# Altium schematic sheet mcu.SchDoc
size A3
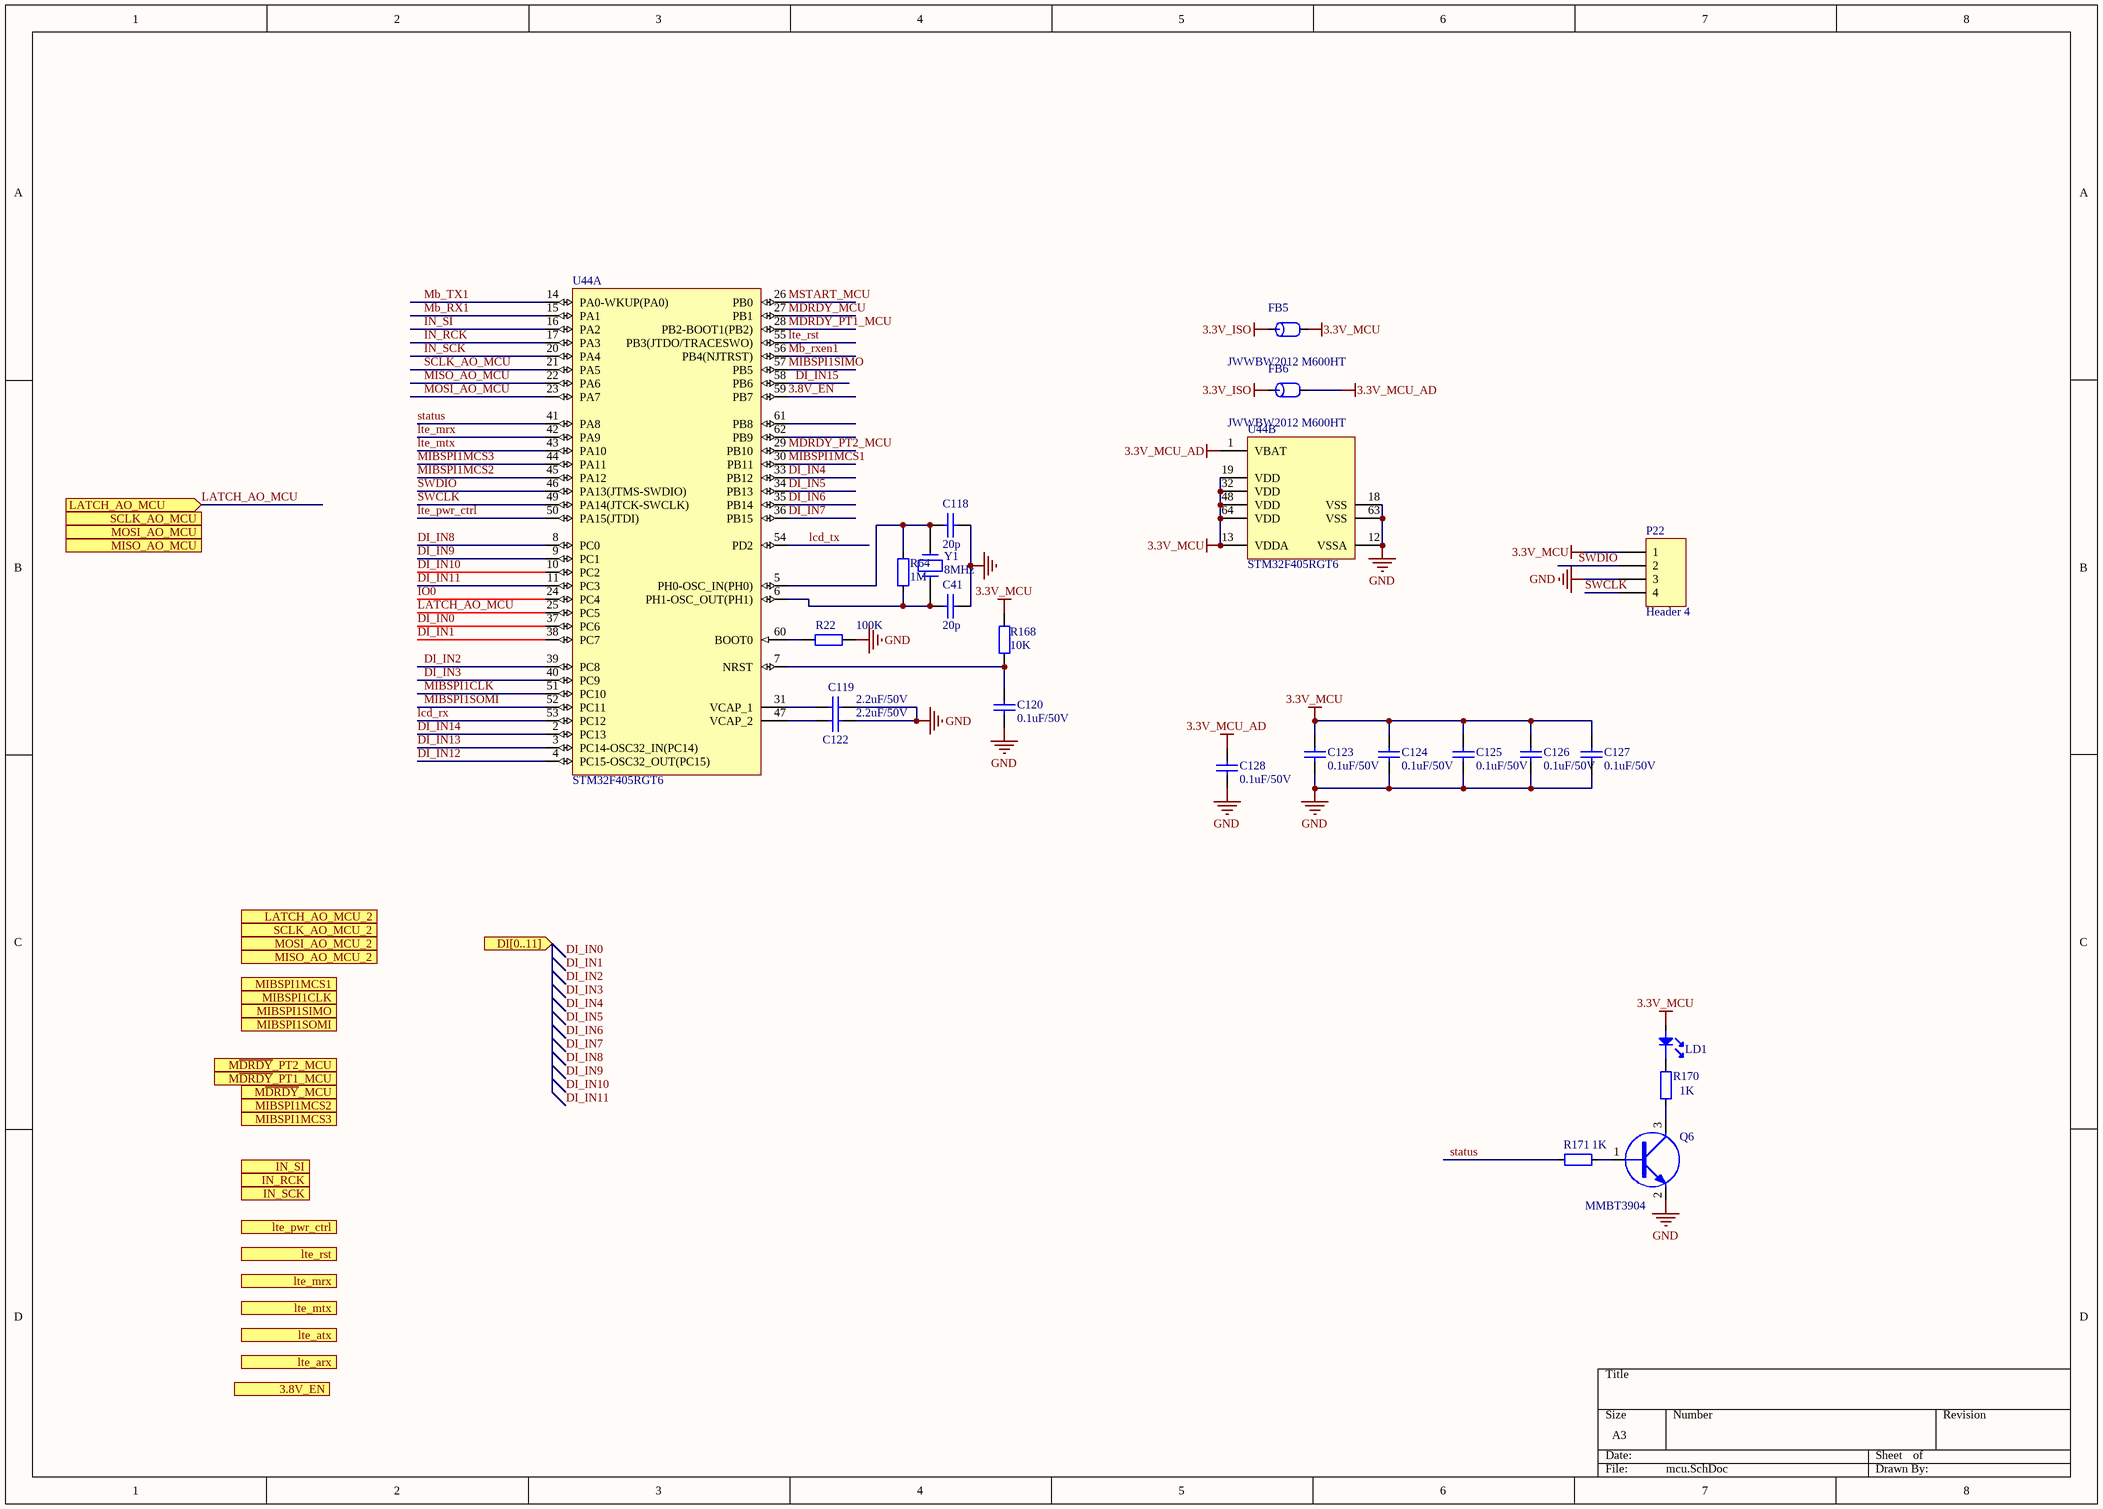
[diagram p0: mcu.SchDoc]

## Parts
C41  20p  [0603c]
C118  20p  [0603c]
C119  2.2uF/50V  [0603C]
C120  0.1uF/50V  [0603C]
C122  2.2uF/50V  [0603C]
C123  0.1uF/50V  [0603C]
C124  0.1uF/50V  [0603C]
C125  0.1uF/50V  [0603C]
C126  0.1uF/50V  [0603C]
C127  0.1uF/50V  [0603C]
C128  0.1uF/50V  [0603C]
FB5  JWWBW2012 M600HT  [0805R]
FB6  JWWBW2012 M600HT  [0805R]
LD1  LED_Green_19-217  [0603led]  (value not drawn)
P22  Header 4  [HDR1X4]
Q6  MMBT3904  [SOT23-3]
R22  100K  [0603R]
R64  1M  [0603R]
R168  10K  [0603R]
R170  1K  [0603r]
R171  1K  [0603r]
U44  STM32F405RGT6  [LQFP-64]  (parts A,B of 2)
Y1  8MHz  [CRAY_5032]

## Ports
3.8V_EN (out), DI[0..11] (in), IN_RCK (out), IN_SCK (out), IN_SI (out), LATCH_AO_MCU (in), LATCH_AO_MCU_2 (out), lte_arx (out), lte_atx (in), lte_mrx (out), lte_mtx (in), lte_pwr_ctrl (out), lte_rst (out), MIBSPI1CLK (in), MIBSPI1MCS1 (in), MIBSPI1MCS2 (in), MIBSPI1MCS3 (in), MIBSPI1SIMO (in), MIBSPI1SOMI (out), MISO_AO_MCU (out), MISO_AO_MCU_2 (in), MOSI_AO_MCU (in), MOSI_AO_MCU_2 (out), M~{DRDY}_MCU (out), M~{DRDY}_PT1_MCU (in), M~{DRDY}_PT2_MCU (in), SCLK_AO_MCU (in), SCLK_AO_MCU_2 (out)

## Nets
3.3V_ISO: FB5.1 FB6.1
3.3V_MCU: C123.2 C124.2 C125.2 C126.2 C127.2 FB5.2 LD1.1 P22.1 R168.2 U44.13(VDDA) U44.19(VDD) U44.32(VDD) U44.48(VDD) U44.64(VDD)
3.3V_MCU_AD: C128.2 FB6.2 U44.1(VBAT)
GND: C41.1 C118.1 C119.1 C120.1 C122.1 C123.1 C124.1 C125.1 C126.1 C127.1 C128.1 P22.3 Q6.2(E) R22.2 U44.12(VSSA) U44.18(VSS) U44.63(VSS)
3.8V_EN: U44.59(PB7)
DI_IN0: U44.37(PC6)
DI_IN1: U44.38(PC7)
DI_IN2: U44.39(PC8)
DI_IN3: U44.40(PC9)
DI_IN4: U44.33(PB12)
DI_IN5: U44.34(PB13)
DI_IN6: U44.35(PB14)
DI_IN7: U44.36(PB15)
DI_IN8: U44.8(PC0)
DI_IN9: U44.9(PC1)
DI_IN10: U44.10(PC2)
DI_IN11: U44.11(PC3)
DI_IN12: U44.4(PC15-OSC32_OUT(PC15))
DI_IN13: U44.3(PC14-OSC32_IN(PC14))
DI_IN14: U44.2(PC13)
DI_IN15: U44.58(PB6)
IN_RCK: U44.17(PA3)
IN_SCK: U44.20(PA4)
IN_SI: U44.16(PA2)
IO0: U44.24(PC4)
LATCH_AO_MCU: U44.25(PC5) ; port LATCH_AO_MCU
lcd_rx: U44.53(PC12)
lcd_tx: U44.54(PD2)
lte_mrx: U44.42(PA9)
lte_mtx: U44.43(PA10)
lte_pwr_ctrl: U44.50(PA15(JTDI))
lte_rst: U44.55(PB3(JTDO/TRACESWO))
Mb_RX1: U44.15(PA1)
Mb_rxen1: U44.56(PB4(NJTRST))
Mb_TX1: U44.14(PA0-WKUP(PA0))
M~{DRDY}_MCU: U44.27(PB1)
M~{DRDY}_PT1_MCU: U44.28(PB2-BOOT1(PB2))
M~{DRDY}_PT2_MCU: U44.29(PB10)
MIBSPI1CLK: U44.51(PC10)
MIBSPI1MCS1: U44.30(PB11)
MIBSPI1MCS2: U44.45(PA12)
MIBSPI1MCS3: U44.44(PA11)
MIBSPI1SIMO: U44.57(PB5)
MIBSPI1SOMI: U44.52(PC11)
MISO_AO_MCU: U44.22(PA6)
MOSI_AO_MCU: U44.23(PA7)
MSTART_MCU: U44.26(PB0)
SCLK_AO_MCU: U44.21(PA5)
status: R171.1 U44.41(PA8)
SWCLK: P22.4 U44.49(PA14(JTCK-SWCLK))
SWDIO: P22.2 U44.46(PA13(JTMS-SWDIO))
NetC41_2: C41.2 R64.1 U44.6(PH1-OSC_OUT(PH1)) Y1.2
NetC118_2: C118.2 R64.2 U44.5(PH0-OSC_IN(PH0)) Y1.1
NetC119_2: C119.2 U44.31(VCAP_1)
NetC120_2: C120.2 R168.1 U44.7(NRST)
NetC122_2: C122.2 U44.47(VCAP_2)
NetLD1_2: LD1.2 R170.1
NetQ6_1: Q6.1(B) R171.2
NetQ6_3: Q6.3(C) R170.2
NetR22_1: R22.1 U44.60(BOOT0)

Not connected (* = marked no-connect by the designer): U44 61(PB8) 62(PB9)

## Notes on the sheet
- Labels drawn without touching a wire or pin: DI_IN0, DI_IN1, DI_IN2, DI_IN3, DI_IN4, DI_IN5, DI_IN6, DI_IN7, DI_IN8, DI_IN9, DI_IN10, DI_IN11

## Library data of the parts
C41 C118 = CAP: Capacitor
C119 C120 C122-C128 = Cap: Capacitor; Value: 22nF; Published: 8-Jun-2000; LatestRevisionDate: 17-Jul-2002; LatestRevisionNote: Re-released for DXP Platform.; PackageReference: RAD-0.3; Publisher: Altium Limited; PackageDescription: Radial Cap, Thru-Hole; 2 Leads; 0.3 in Pin Spacing
FB5 FB6 = FB: Part Field 1: 磁珠/0603/1K ohm/100MHz; FB: BLM18BD102SN1(muRata); Text Field1: FB
LD1 = LED_Green_19-217: 物料主编码(PN): 100000032; Value: 19-217/G7C-AN1P2/3T; ID: 6; 序号: 33; 物料名称: 绿色LED; 物料描述: Other,LED,绿色,0603,1.6X0.8X0.4mm,19-217/G7C-AN1P2/3T; 工作温度: –40°C to 85°C; 制造商: Everlight; 器件等级: ——; 物料类型: 特殊二极管; 规格型号(完整型号): 19-217/G7C-AN1P2/3T
P22 = Header 4: Header, 4-Pin; LatestRevisionDate: 17-Jul-2002; LatestRevisionNote: Re-released for DXP Platform.; Publisher: Altium Limited
Q6 = NPN_MMBT3904
R22 R168 = Res0805M
R64 R170 R171 = RES0603: 物料主编码(PN): 150000040; ID: 233; 序号: 109; 物料名称: 贴片电阻; 精度: ±1%; 规格型号(完整型号): RC1608F103CS/RC0603FR-0710KL; 物料描述: RES,贴片电阻,0603,10k,±1%,1/10W,1.6X0.8X0.45mm,RC1608F103CS/RC0603FR-0710KL; 工作温度: –55°C to 155°C; 制造商: 三星/YAGEO; 器件等级: ——; 物料类型: 表贴电阻; 参数值: 1.00E+04
  R64: Value: 1M
  R170 R171: Value: 1K
U44 = STM32F405RGT6: ARM Cortex-M4 32-bit MCU+FPU, 210 DMIPS, 1024 kB Flash, 192 kB Internal RAM, 51 I/Os, 64-pin LQFP, -40 to 85 degC, Tray; Manufacturer: STMicroelectronics; D/A Converter: 2x12-bit; FLASH Size (Prog) (kB): 1024; I/Os (High Current): 51; Internal RAM Size (kB): 192; Operating Frequency(F) (Processor speed) (MHz): 168; Supply Voltage(Vcc) max (V): 3.6; Supply Voltage(Vcc) min (V): 1.8; DatasheetVersion: Rev. 4; PackageVersion: Rev. 4, 06/2013; PackageReference: LQFP64; PackageDescription: 64-Pin Low Profile Quad Flat Package, 10 x 10 mm Body, 0.5 mm Pitch; Supplier 1: Digi-Key; Supplier Part Number 1: 497-11767-ND; Supplier 2: Farnell; Supplier Part Number 2: 2064363; Supplier 3: Newark; Supplier Part Number 3: 73T2329; Supplier 4: Mouser; Supplier Part Number 4: 511-STM32F405RGT6; Core: ARM Cortex-M4; Packing: Tray; Mounting Technology: Surface Mount; PartNumber: STM32F405RGT6; ComponentLink1Description: Manufacturer URL; ComponentLink1URL: http://www.st.com/web/en/home.html; ComponentLink2Description: Datasheet; ComponentLink2URL: http://www.st.com/st-web-ui/static/active/en/resource/technical/document/datasheet/DM00037051.pdf; ComponentLink3Description: Package Specification; ComponentLink3URL: http://www.st.com/st-web-ui/static/active/en/resource/technical/document/datasheet/DM00037051.pdf
Y1 = CRYSTAL: HC49S-8MHz